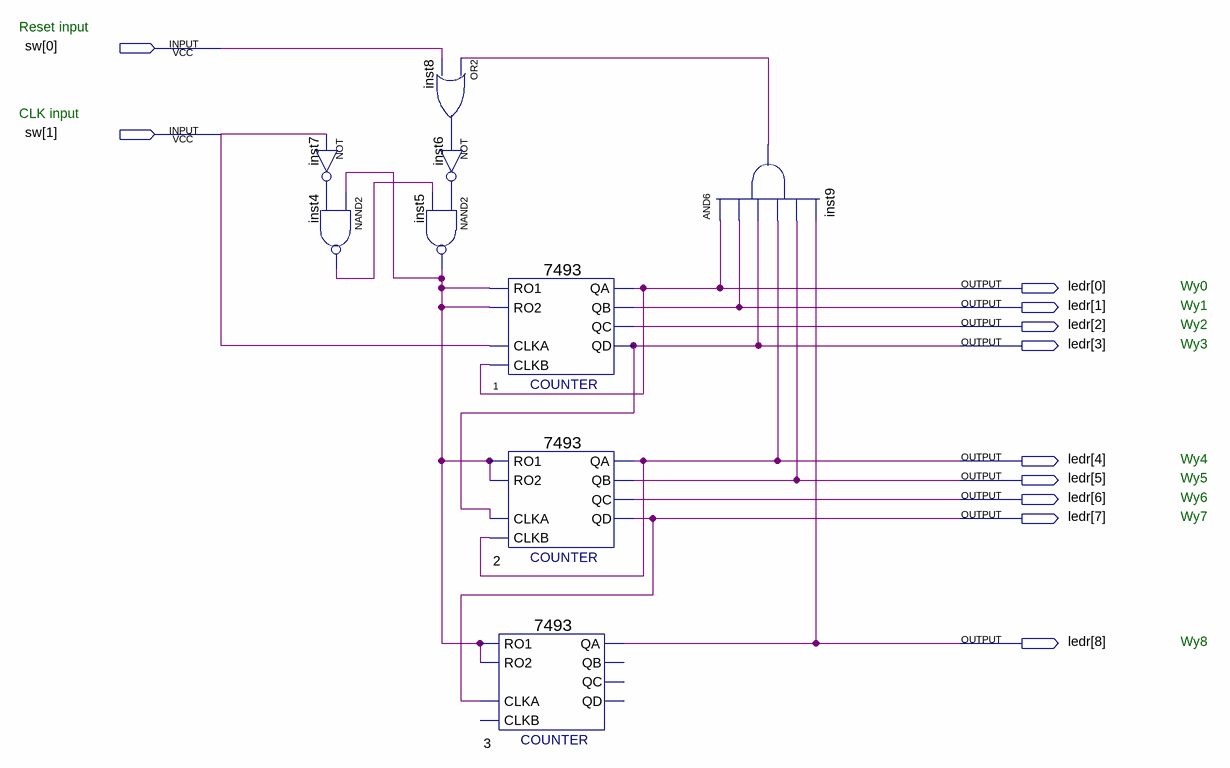
[diagram p0: schematic sheet]
// Quartus schematic mod315_async.bdf as structural Verilog: 9 symbols, 11 pins
module mod315_async (
  input  [1:0] sw,
  output [8:0] ledr
);

  wire inst4_out, inst5_out, inst6_out, inst7_out, inst8_out, inst9_out;

  not inst7 (inst7_out, sw[1]);
  nand inst4 (inst4_out, inst5_out, inst7_out);
  or inst8 (inst8_out, inst9_out, sw[0]);
  not inst6 (inst6_out, inst8_out);
  nand inst5 (inst5_out, inst6_out, inst4_out);
  \7493  u_3 (.RO1(inst5_out), .RO2(inst5_out), .CLKA(ledr[7]), .QA(ledr[8]));  // open: CLKB, QC, QB, QD
  \7493  u_1 (
    .RO1(inst5_out), .RO2(inst5_out), .CLKA(sw[1]), .CLKB(ledr[0]), .QC(ledr[2]), .QB(ledr[1]), .QA(ledr[0]),
    .QD(ledr[3]));
  \7493  u_2 (
    .RO1(inst5_out), .RO2(inst5_out), .CLKA(ledr[3]), .CLKB(ledr[4]), .QC(ledr[6]), .QB(ledr[5]),
    .QA(ledr[4]), .QD(ledr[7]));
  and inst9 (inst9_out, ledr[0], ledr[1], ledr[3], ledr[4], ledr[5], ledr[8]);

  // Notes on the sheet:
  //   Reset input
  //   CLK input
  //   Wy0
  //   Wy1
  //   Wy2
  //   Wy3
  //   Wy4
  //   Wy5
  //   Wy6
  //   Wy7
  //   Wy8
endmodule
